# Altium schematic sheet MAXLINEAR USB TO 4 CHANNEL TTL CONVERTER.SchDoc
size A3; SheetNumber: 1; SheetTotal: 1
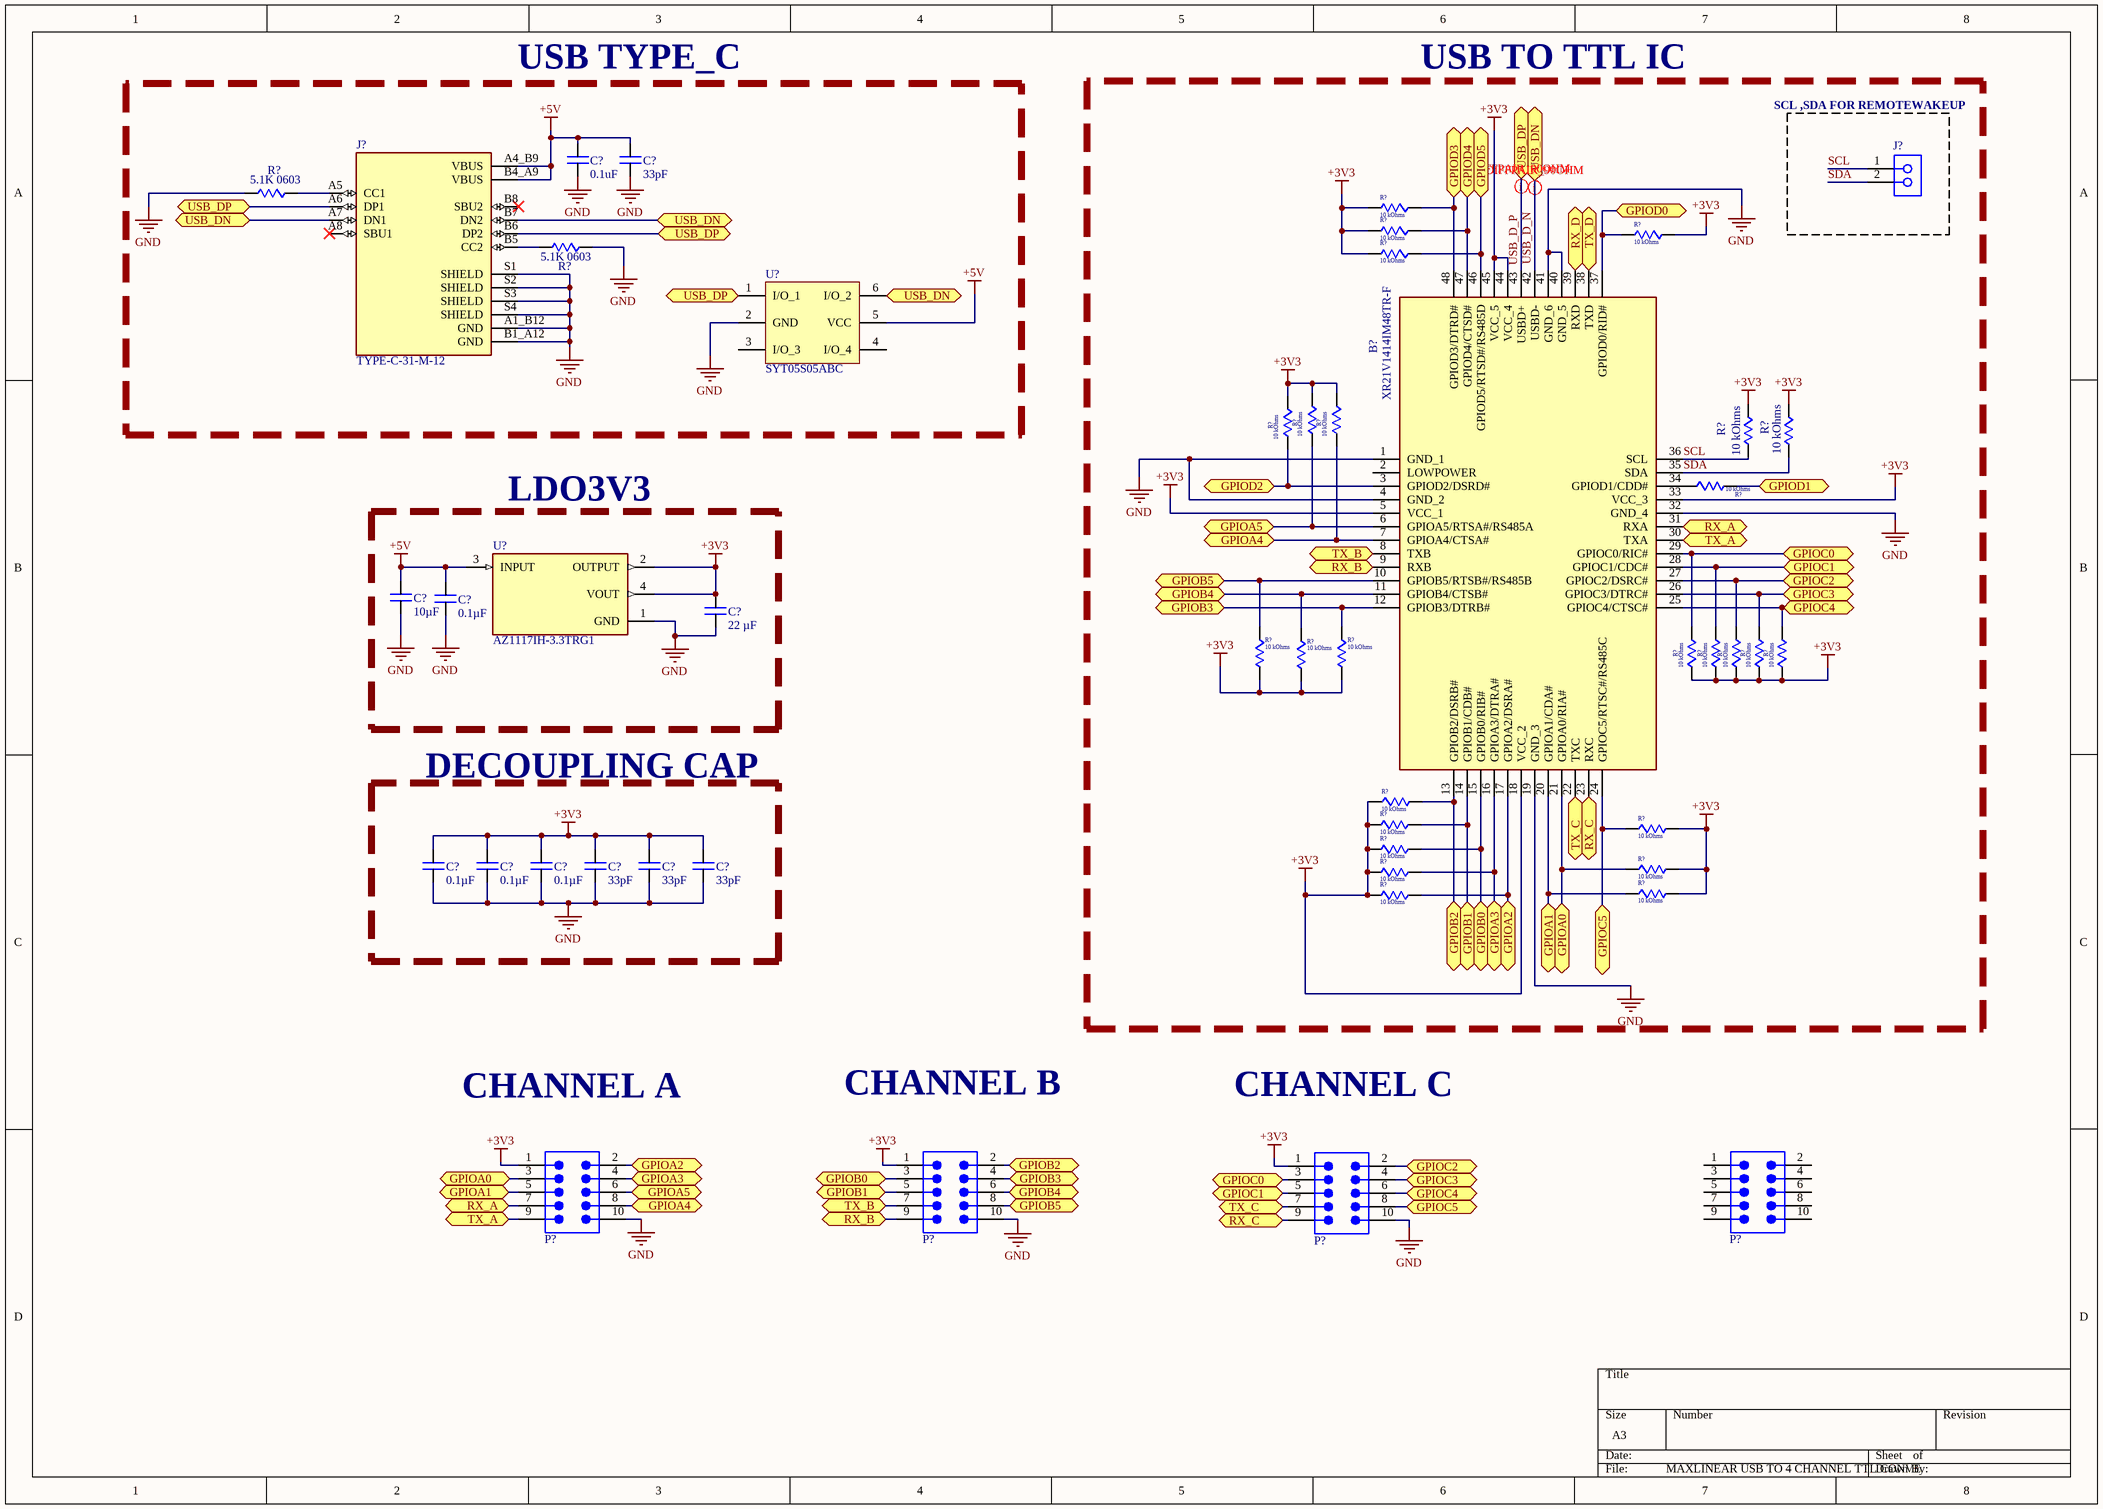
[diagram p0: MAXLINEAR USB TO 4 CHANNEL TTL CONVERTER.SchDoc]

## Parts
(Parts that share a designator on the sheet are numbered #1, #2 ... from top to bottom, then left to right.)
B?  XR21V1414IM48TR-F  [QFP50P900X900X120-48N]
C?#1  value 0.1uF  [CAPC1608X90N]  (hidden comment: 0.1 µF)
C?#2  value 33pF  [CAPC1608X90N]  (hidden comment: 33 pF)
C?#3  value 10µF  [CAP-0805]  (hidden comment: 10 µF)
C?#4  value 0.1µF  [CAP-0805]  (hidden comment: 0.1 µF)
C?#5  22 µF  [CAPC1608X90N]
C?#6  value 0.1µF  [CAPC1608X90N]  (hidden comment: 0.1 µF)
C?#7  value 0.1µF  [CAPC1608X90N]  (hidden comment: 0.1 µF)
C?#8  value 0.1µF  [CAPC1608X90N]  (hidden comment: 0.1 µF)
C?#9  value 33pF  [CAPC1608X90N]  (hidden comment: 33 pF)
C?#10  value 33pF  [CAPC1608X90N]  (hidden comment: 33 pF)
C?#11  value 33pF  [CAPC1608X90N]  (hidden comment: 33 pF)
J?#1  613002143121  [613002143121]  (value not drawn)
J?#2  TYPE-C-31-M-12  [HRO_TYPE-C-31-M-12]
P?#1  61301021021  [61301021021]  (value not drawn)
P?#2  61301021021  [61301021021]  (value not drawn)
P?#3  61301021021  [61301021021]  (value not drawn)
P?#4  61301021021  [61301021021]  (value not drawn)
R?#1  value 5.1K 0603  [RES-0603]  (hidden comment: 5.1 kOhms ERA-3ARW512V)
R?#2  10 kOhms  [RES-0603]
R?#3  10 kOhms  [RES-0603]
R?#4  10 kOhms  [RES-0603]
R?#5  value 5.1K 0603  [RES-0603]  (hidden comment: 5.1 kOhms ERA-3ARW512V)
R?#6  10 kOhms  [RES-0603]
R?#7  10 kOhms  [RES-0603]
R?#8  10 kOhms  [RES-0603]
R?#9  10 kOhms  [RES-0603]
R?#10  10 kOhms  [RES-0603]
R?#11  10 kOhms  [RES-0603]
R?#12  10 kOhms  [RES-0603]
R?#13  10 kOhms  [RES-0603]
R?#14  10 kOhms  [RES-0603]
R?#15  10 kOhms  [RES-0603]
R?#16  10 kOhms  [RES-0603]
R?#17  10 kOhms  [RES-0603]
R?#18  10 kOhms  [RES-0603]
R?#19  10 kOhms  [RES-0603]
R?#20  10 kOhms  [RES-0603]
R?#21  10 kOhms  [RES-0603]
R?#22  10 kOhms  [RES-0603]
R?#23  10 kOhms  [RES-0603]
R?#24  10 kOhms  [RES-0603]
R?#25  10 kOhms  [RES-0603]
R?#26  10 kOhms  [RES-0603]
R?#27  10 kOhms  [RES-0603]
R?#28  10 kOhms  [RES-0603]
U?#1  SYT05S05ABC  [SYT05S05ABC]
U?#2  AZ1117IH-3.3TRG1  [SOT230P700X185-4N]

## Blocks framed on the sheet
USB TYPE_C: C?#1 C?#2 J?#2 R?#1 R?#5 U?#1
USB TO TTL IC: B? J?#1 R?#2-R?#4 R?#6-R?#28
LDO3V3: C?#3-C?#5 U?#2
DECOUPLING CAP: C?#6-C?#11

## Ports
GPIOA0 (bidir, see MAXLINEAR USB TO 4 CHANNEL TTL CONVERTER[2D]), GPIOA0 (bidir, see MAXLINEAR USB TO 4 CHANNEL TTL CONVERTER[6C]), GPIOA1 (bidir, see MAXLINEAR USB TO 4 CHANNEL TTL CONVERTER[2D]), GPIOA1 (bidir, see MAXLINEAR USB TO 4 CHANNEL TTL CONVERTER[6C]), GPIOA2 (bidir, see MAXLINEAR USB TO 4 CHANNEL TTL CONVERTER[3D]), GPIOA2 (bidir, see MAXLINEAR USB TO 4 CHANNEL TTL CONVERTER[6C]), GPIOA3 (bidir, see MAXLINEAR USB TO 4 CHANNEL TTL CONVERTER[3D]), GPIOA3 (bidir, see MAXLINEAR USB TO 4 CHANNEL TTL CONVERTER[6C]), GPIOA4 (bidir, see MAXLINEAR USB TO 4 CHANNEL TTL CONVERTER[3D]), GPIOA4 (bidir, see MAXLINEAR USB TO 4 CHANNEL TTL CONVERTER[5B]), GPIOA5 (bidir, see MAXLINEAR USB TO 4 CHANNEL TTL CONVERTER[3D]), GPIOA5 (bidir, see MAXLINEAR USB TO 4 CHANNEL TTL CONVERTER[5B]), GPIOB0 (bidir, see MAXLINEAR USB TO 4 CHANNEL TTL CONVERTER[4D]), GPIOB0 (bidir, see MAXLINEAR USB TO 4 CHANNEL TTL CONVERTER[6C]), GPIOB1 (bidir, see MAXLINEAR USB TO 4 CHANNEL TTL CONVERTER[4D]), GPIOB1 (bidir, see MAXLINEAR USB TO 4 CHANNEL TTL CONVERTER[6C]), GPIOB2 (bidir, see MAXLINEAR USB TO 4 CHANNEL TTL CONVERTER[4D]), GPIOB2 (bidir, see MAXLINEAR USB TO 4 CHANNEL TTL CONVERTER[6C]), GPIOB3 (bidir, see MAXLINEAR USB TO 4 CHANNEL TTL CONVERTER[4D]), GPIOB3 (bidir, see MAXLINEAR USB TO 4 CHANNEL TTL CONVERTER[5B]), GPIOB4 (bidir, see MAXLINEAR USB TO 4 CHANNEL TTL CONVERTER[4D]), GPIOB4 (bidir, see MAXLINEAR USB TO 4 CHANNEL TTL CONVERTER[5B]), GPIOB5 (bidir, see MAXLINEAR USB TO 4 CHANNEL TTL CONVERTER[4D]), GPIOB5 (bidir, see MAXLINEAR USB TO 4 CHANNEL TTL CONVERTER[5B]), GPIOC0 (bidir, see MAXLINEAR USB TO 4 CHANNEL TTL CONVERTER[5D]), GPIOC0 (bidir, see MAXLINEAR USB TO 4 CHANNEL TTL CONVERTER[7B]), GPIOC1 (bidir, see MAXLINEAR USB TO 4 CHANNEL TTL CONVERTER[5D]), GPIOC1 (bidir, see MAXLINEAR USB TO 4 CHANNEL TTL CONVERTER[7B]), GPIOC2 (bidir, see MAXLINEAR USB TO 4 CHANNEL TTL CONVERTER[6D]), GPIOC2 (bidir, see MAXLINEAR USB TO 4 CHANNEL TTL CONVERTER[7B]), GPIOC3 (bidir, see MAXLINEAR USB TO 4 CHANNEL TTL CONVERTER[6D]), GPIOC3 (bidir, see MAXLINEAR USB TO 4 CHANNEL TTL CONVERTER[7B]), GPIOC4 (bidir, see MAXLINEAR USB TO 4 CHANNEL TTL CONVERTER[6D]), GPIOC4 (bidir, see MAXLINEAR USB TO 4 CHANNEL TTL CONVERTER[7B]), GPIOC5 (bidir, see MAXLINEAR USB TO 4 CHANNEL TTL CONVERTER[6D]), GPIOC5 (bidir, see MAXLINEAR USB TO 4 CHANNEL TTL CONVERTER[7C]), GPIOD0 (bidir), GPIOD1 (bidir), GPIOD2 (bidir), GPIOD3 (bidir), GPIOD4 (bidir), GPIOD5 (bidir), RX_A (bidir, see MAXLINEAR USB TO 4 CHANNEL TTL CONVERTER[2D]), RX_A (bidir, see MAXLINEAR USB TO 4 CHANNEL TTL CONVERTER[7B]), RX_B (bidir, see MAXLINEAR USB TO 4 CHANNEL TTL CONVERTER[4D]), RX_B (bidir, see MAXLINEAR USB TO 4 CHANNEL TTL CONVERTER[5B]), RX_C (bidir, see MAXLINEAR USB TO 4 CHANNEL TTL CONVERTER[5D]), RX_C (bidir, see MAXLINEAR USB TO 4 CHANNEL TTL CONVERTER[7C]), RX_D (bidir), TX_A (bidir, see MAXLINEAR USB TO 4 CHANNEL TTL CONVERTER[2D]), TX_A (bidir, see MAXLINEAR USB TO 4 CHANNEL TTL CONVERTER[7B]), TX_B (bidir, see MAXLINEAR USB TO 4 CHANNEL TTL CONVERTER[4D]), TX_B (bidir, see MAXLINEAR USB TO 4 CHANNEL TTL CONVERTER[5B]), TX_C (bidir, see MAXLINEAR USB TO 4 CHANNEL TTL CONVERTER[5D]), TX_C (bidir, see MAXLINEAR USB TO 4 CHANNEL TTL CONVERTER[7C]), TX_D (bidir), USB_DN (bidir, see MAXLINEAR USB TO 4 CHANNEL TTL CONVERTER[1A], MAXLINEAR USB TO 4 CHANNEL TTL CONVERTER[3A], MAXLINEAR USB TO 4 CHANNEL TTL CONVERTER[4A]), USB_DN (bidir, see MAXLINEAR USB TO 4 CHANNEL TTL CONVERTER[1A], MAXLINEAR USB TO 4 CHANNEL TTL CONVERTER[3A], MAXLINEAR USB TO 4 CHANNEL TTL CONVERTER[6A]), USB_DN (bidir, see MAXLINEAR USB TO 4 CHANNEL TTL CONVERTER[1A], MAXLINEAR USB TO 4 CHANNEL TTL CONVERTER[4A], MAXLINEAR USB TO 4 CHANNEL TTL CONVERTER[6A]), USB_DN (bidir, see MAXLINEAR USB TO 4 CHANNEL TTL CONVERTER[3A], MAXLINEAR USB TO 4 CHANNEL TTL CONVERTER[4A], MAXLINEAR USB TO 4 CHANNEL TTL CONVERTER[6A]), USB_DP (bidir, see MAXLINEAR USB TO 4 CHANNEL TTL CONVERTER[1A], MAXLINEAR USB TO 4 CHANNEL TTL CONVERTER[3A]), USB_DP (bidir, see MAXLINEAR USB TO 4 CHANNEL TTL CONVERTER[1A], MAXLINEAR USB TO 4 CHANNEL TTL CONVERTER[3A], MAXLINEAR USB TO 4 CHANNEL TTL CONVERTER[6A]), USB_DP (bidir, see MAXLINEAR USB TO 4 CHANNEL TTL CONVERTER[3A], MAXLINEAR USB TO 4 CHANNEL TTL CONVERTER[6A])

## Nets
+3V3: B?.5(VCC_1) B?.18(VCC_2) B?.33(VCC_3) B?.44(VCC_4) B?.45(VCC_5) C?#5.1 C?#6.1 C?#7.1 C?#8.1 C?#9.1 C?#10.1 C?#11.1 P?#1.1 P?#2.1 P?#3.1 R?#2.1 R?#3.1 R?#4.2 R?#6.1 R?#7.2 R?#8.2 R?#9.2 R?#10.2 R?#11.2 R?#13.1 R?#14.1 R?#15.1 R?#16.2 R?#17.2 R?#18.2 R?#19.2 R?#20.2 R?#21.2 R?#22.2 R?#23.1 R?#24.2 R?#25.2 R?#26.1 R?#27.2 R?#28.1 U?#2.2(OUTPUT) U?#2.4(VOUT)
+5V: C?#1.1 C?#2.1 C?#3.1 C?#4.1 J?#2.A4_B9(VBUS) J?#2.B4_A9(VBUS) U?#1.5(VCC) U?#2.3(INPUT)
GND: B?.1(GND_1) B?.4(GND_2) B?.19(GND_3) B?.32(GND_4) B?.40(GND_5) B?.41(GND_6) C?#1.2 C?#2.2 C?#3.2 C?#4.2 C?#5.2 C?#6.2 C?#7.2 C?#8.2 C?#9.2 C?#10.2 C?#11.2 J?#2.A1_B12(GND) J?#2.B1_A12(GND) J?#2.S1(SHIELD) J?#2.S2(SHIELD) J?#2.S3(SHIELD) J?#2.S4(SHIELD) P?#1.10 P?#2.10 P?#3.10 R?#1.1 R?#5.2 U?#1.2(GND) U?#2.1(GND)
GPIOA0: B?.21(GPIOA0/RIA#) P?#1.3 R?#26.2 ; port GPIOA0
GPIOA1: B?.20(GPIOA1/CDA#) P?#1.5 R?#28.2 ; port GPIOA1
GPIOA2: B?.17(GPIOA2/DSRA#) P?#1.2 R?#27.1 ; port GPIOA2
GPIOA3: B?.16(GPIOA3/DTRA#) P?#1.4 R?#25.1 ; port GPIOA3
GPIOA4: B?.7(GPIOA4/CTSA#) P?#1.8 R?#8.1 ; port GPIOA4
GPIOA5: B?.6(GPIOA5/RTSA#/RS485A) P?#1.6 R?#7.1 ; port GPIOA5
GPIOB0: B?.15(GPIOB0/RIB#) P?#2.3 R?#24.1 ; port GPIOB0
GPIOB1: B?.14(GPIOB1/CDB#) P?#2.5 R?#22.1 ; port GPIOB1
GPIOB2: B?.13(GPIOB2/DSRB#) P?#2.2 R?#21.1 ; port GPIOB2
GPIOB3: B?.12(GPIOB3/DTRB#) P?#2.4 R?#15.2 ; port GPIOB3
GPIOB4: B?.11(GPIOB4/CTSB#) P?#2.6 R?#14.2 ; port GPIOB4
GPIOB5: B?.10(GPIOB5/RTSB#/RS485B) P?#2.8 R?#13.2 ; port GPIOB5
GPIOC0: B?.29(GPIOC0/RIC#) P?#3.3 R?#16.1 ; port GPIOC0
GPIOC1: B?.28(GPIOC1/CDC#) P?#3.5 R?#17.1 ; port GPIOC1
GPIOC2: B?.27(GPIOC2/DSRC#) P?#3.2 R?#18.1 ; port GPIOC2
GPIOC3: B?.26(GPIOC3/DTRC#) P?#3.4 R?#19.1 ; port GPIOC3
GPIOC4: B?.25(GPIOC4/CTSC#) P?#3.6 R?#20.1 ; port GPIOC4
GPIOC5: B?.24(GPIOC5/RTSC#/RS485C) P?#3.8 R?#23.2 ; port GPIOC5
GPIOD0: B?.37(GPIOD0/RID#) R?#4.1 ; port GPIOD0
GPIOD1: R?#12.1 ; port GPIOD1
GPIOD2: B?.3(GPIOD2/DSRD#) R?#9.1 ; port GPIOD2
GPIOD3: B?.48(GPIOD3/DTRD#) R?#2.2 ; port GPIOD3
GPIOD4: B?.47(GPIOD4/CTSD#) R?#3.2 ; port GPIOD4
GPIOD5: B?.46(GPIOD5/RTSD#/RS485D) R?#6.2 ; port GPIOD5
RX_A: B?.31(RXA) P?#1.7 ; port RX_A
RX_B: B?.9(RXB) P?#2.9 ; port RX_B
RX_C: B?.23(RXC) P?#3.9 ; port RX_C
RX_D: B?.39(RXD) ; port RX_D
SCL: B?.36(SCL) J?#1.1 R?#10.1
SDA: B?.35(SDA) J?#1.2 R?#11.1
TX_A: B?.30(TXA) P?#1.9 ; port TX_A
TX_B: B?.8(TXB) P?#2.7 ; port TX_B
TX_C: B?.22(TXC) P?#3.7 ; port TX_C
TX_D: B?.38(TXD) ; port TX_D
USB_D_N: B?.42(USBD-) J?#2.A7(DN1) J?#2.B7(DN2) U?#1.6(I/O_2) ; port USB_DN
USB_D_P: B?.43(USBD+) J?#2.A6(DP1) J?#2.B6(DP2) U?#1.1(I/O_1) ; port USB_DP
NetB?_34: B?.34(GPIOD1/CDD#) R?#12.2
NetJ?#2_A5: J?#2.A5(CC1) R?#1.2
NetJ?#2_B5: J?#2.B5(CC2) R?#5.1

Not connected (* = marked no-connect by the designer): B? 2(LOWPOWER); J?#2 A8(SBU1)* B8(SBU2)*; P?#4 1 2 3 4 5 6 7 8 9 10; U?#1 3(I/O_3) 4(I/O_4)

## Layout directives
differential pair: USB_D_N, USB_D_P

## Notes on the sheet
- SCL ,SDA FOR REMOTEWAKEUP
- CHANNEL A
- CHANNEL B
- CHANNEL C

## Library data of the parts
B? = XR21V1414IM48-F: USB Interface IC 4-Ch 12Mbps 48MHz Internal clock; UART; Manufacturer_Name: MaxLinear, Inc.; Geometry.Height: 1.2mm; Manufacturer_Part_Number: XR21V1414IM48-F; Mouser Part Number: 701-XR21V1414IM48-F; Mouser Price/Stock: https://www.mouser.co.uk/ProductDetail/MaxLinear/XR21V1414IM48-F?qs=ffYlDyDpdDVv7svdbXLjeg%3D%3D; Arrow Part Number: XR21V1414IM48-F; Arrow Price/Stock: https://www.arrow.com/en/products/xr21v1414im48-f/maxlinear-inc?region=nac; Datasheet Link: https://www.maxlinear.com/document?id=1416
C?#1 = CC0603KRX7R0BB104: 0.1 µF ±10% 100V Ceramic Capacitor X7R 0603 (1608 Metric); Supplier 1: Future Electronics; Supplier Part Number 1: 5049188; Package: 0603
C?#2 C?#9-C?#11 = KGM15ACG1H330JT: 33 pF ±5% 50V Ceramic Capacitor C0G, NP0 0603 (1608 Metric); Supplier 1: Arrow Electronics; Supplier Part Number 1: KGM15ACG1H330JT; Package: 0603
C?#3 = GRM21BR61H106KE43K: 10 µF ±10% 50V Ceramic Capacitor X5R 0805 (2012 Metric); Supplier 1: Mouser; Supplier Part Number 1: 81-GRM21BR61H106KE3K; Package: 0805
C?#4 = C0805C104K1RACTU: 0.1 µF ±10% 100V Ceramic Capacitor X7R 0805 (2012 Metric); Supplier 1: Mouser; Supplier Part Number 1: 80-C0805C104K1R; Package: 0805
C?#5 = GRM188R61A226ME15J: 22 µF ±20% 10V Ceramic Capacitor X5R 0603 (1608 Metric); Value: 22µF; Supplier 1: Future Electronics; Supplier Part Number 1: 8126166; Package: 0603
C?#6-C?#8 = C0603C104J5RAC7867: 0.1 µF ±5% 50V Ceramic Capacitor X7R 0603 (1608 Metric); Supplier 1: Mouser; Supplier Part Number 1: 80-C0603C104J5R; Package: 0603
J?#1 = 613002143121: WR-PHD Socket Header, THT, Angled, pitch 2.54mm, 1 Row, 2P; Manufacturer: Wurth Elektronik; Contact Resistance: 20mOhm; Rated Current: 3A; Working Voltage: 250V; Withstanding Voltage: 500V; Manufacturer Part Number: 613002143121; Category: Board-to-Board Connectors; Match Code: WR-PHD; ComponentLink1Description: Website Link; ComponentLink1URL: https://www.we-online.com/redexpert/article/613002143121?ad; ComponentLink2Description: Datasheet Link; ComponentLink2URL: https://www.we-online.com/redexpert/spec/613002143121?ad; Mount: Through Hole; Operating Temperature Max: 125°C; Operating Temperature Min: -40°C; Packaging: Tray; Gender: Socket Header; Number of Pins: 2; Number of Rows: 1; Orientation: Angled; Pitch: 2.54mm
J?#2 = TYPE-C-31-M-12: USB Connectors 24 Receptacle 1 8.94*7.3mm RoHS; MF: HRO Electronics Co., Ltd.; Price: None; Value: *; SnapEDA_Link: https://www.snapeda.com/parts/TYPE-C-31-M-12/HRO+Electronics+Co.%252C+Ltd./view-part/?ref=snap; Package: Package; Availability: Not in stock; Check_prices: https://www.snapeda.com/parts/TYPE-C-31-M-12/HRO+Electronics+Co.%252C+Ltd./view-part/?ref=eda; MP: TYPE-C-31-M-12
P?#1-P?#4 = 61301021021: WR-PHD Pin Header, THT, Angled, pitch 2.54mm, 2 Row, 10P; Manufacturer: Wurth Elektronik; Contact Resistance: 20mOhm; Rated Current: 3A; Working Voltage: 250V; Withstanding Voltage: 500V; Manufacturer Part Number: 61301021021; Category: Board-to-Board Connectors; Match Code: WR-PHD; ComponentLink1Description: Website Link; ComponentLink1URL: https://www.we-online.com/redexpert/article/61301021021?ad; ComponentLink2Description: Datasheet Link; ComponentLink2URL: https://www.we-online.com/redexpert/spec/61301021021?ad; Mount: Through Hole; Operating Temperature Max: 105°C; Operating Temperature Min: -40°C; Packaging: Bag; Gender: Pin Header; Number of Pins: 10; Number of Rows: 2; Orientation: Angled; Pitch: 2.54mm
R?#1 R?#5 = RC0603FR-071KL: ERA-3ARW512V / 5.1 kOhms ±0.05% 0.1W, 1/10W Chip Resistor 0603 (1608 Metric) Automotive AEC-Q200 Thin Film; Supplier 1: Future Electronics; Supplier Part Number 1: 4016291; Package: 0603
R?#2-R?#4 R?#6-R?#28 = RC0603FR-0710KL: 10 kOhms ±1% 0.1W, 1/10W Chip Resistor 0603 (1608 Metric) Moisture Resistant Thick Film; Supplier 1: Future Electronics; Supplier Part Number 1: 4023214; Package: 0603; Value: 10 kOhms
U?#1 = SYT05S05ABC: ESD Protection - USB2.0 Power and Data Line Protection
U?#2 = AZ1117IH-3.3TRG1: Linear Voltage Regulator IC Positive Fixed 1 Output 1A SOT-223-3; MF: Diodes Inc.; Check_prices: https://www.snapeda.com/parts/AZ1117IH-3.3TRG1/Diodes+Inc./view-part/?ref=eda; Value: *; Availability: In Stock; MP: AZ1117IH-3.3TRG1; Price: None; Package: SOT-223 Diodes Inc.; SnapEDA_Link: https://www.snapeda.com/parts/AZ1117IH-3.3TRG1/Diodes+Inc./view-part/?ref=snap; Purchase-URL: https://pricing.snapeda.com/search/part/AZ1117IH-3.3TRG1/?ref=eda